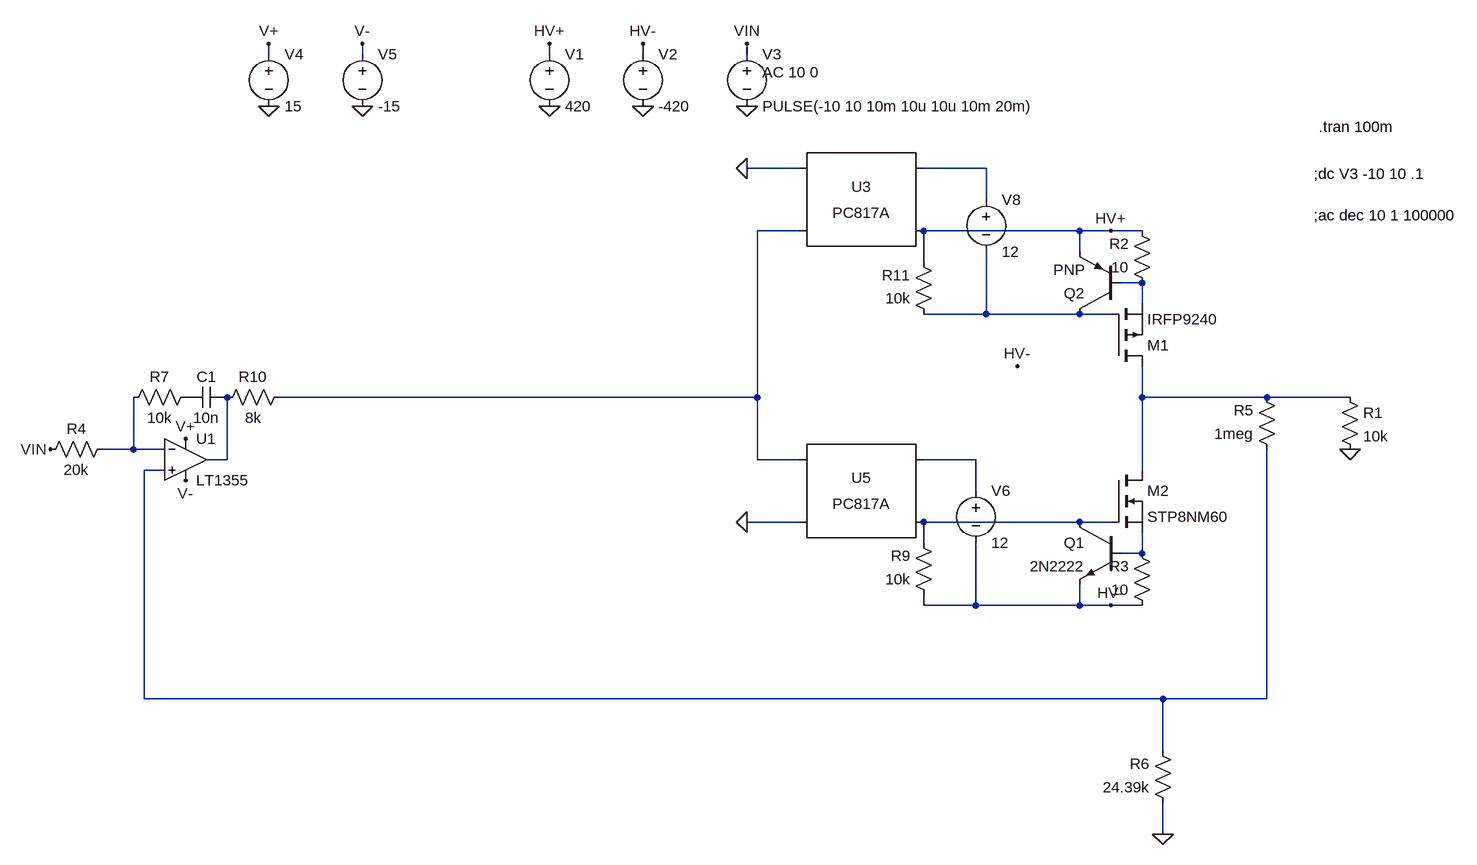
[diagram p0: schematic Draft12.asc]
Draft12.asc, the LTspice schematic file:
Version 4
SHEET 1 968 932
WIRE -976 -336 -976 -352
WIRE -832 -336 -832 -352
WIRE -544 -336 -544 -352
WIRE -400 -336 -400 -352
WIRE -240 -336 -240 -352
WIRE -160 -160 -240 -160
WIRE 128 -160 32 -160
WIRE 128 -112 128 -160
WIRE -160 -64 -224 -64
WIRE 272 -64 32 -64
WIRE 320 -64 272 -64
WIRE 368 -64 320 -64
WIRE 272 -32 272 -64
WIRE 32 -16 32 -64
WIRE 368 16 336 16
WIRE 368 48 368 16
WIRE 128 64 128 -32
WIRE 128 64 32 64
WIRE 272 64 128 64
WIRE 320 64 272 64
WIRE -224 192 -224 -64
WIRE -224 192 -960 192
WIRE 368 192 368 144
WIRE 560 192 368 192
WIRE 688 192 560 192
WIRE -1184 272 -1184 192
WIRE -1184 272 -1232 272
WIRE -1136 272 -1184 272
WIRE -1040 288 -1040 192
WIRE -1040 288 -1072 288
WIRE -224 288 -224 192
WIRE -160 288 -224 288
WIRE 112 288 32 288
WIRE -1136 304 -1168 304
WIRE 368 304 368 192
WIRE 112 336 112 288
WIRE -160 384 -240 384
WIRE 272 384 32 384
WIRE 320 384 272 384
WIRE 32 416 32 384
WIRE 368 432 368 400
WIRE 368 432 336 432
WIRE 32 512 32 496
WIRE 112 512 112 416
WIRE 112 512 32 512
WIRE 272 512 272 480
WIRE 272 512 112 512
WIRE 320 512 272 512
WIRE 368 512 320 512
WIRE -1168 656 -1168 304
WIRE 400 656 -1168 656
WIRE 560 656 560 272
WIRE 560 656 400 656
WIRE 400 736 400 656
WIRE 400 864 400 816
FLAG -544 -256 0
FLAG -400 -256 0
FLAG -240 -256 0
FLAG -544 -352 HV+
FLAG -400 -352 HV-
FLAG -240 -352 VIN
FLAG -976 -256 0
FLAG -832 -256 0
FLAG -976 -352 V+
FLAG -832 -352 V-
FLAG -1104 256 V+
FLAG -1104 320 V-
FLAG -1312 272 VIN
FLAG 400 864 0
FLAG 176 144 HV-
FLAG 320 512 HV-
FLAG 320 -64 HV+
FLAG -240 -160 0
FLAG -240 384 0
FLAG 688 272 0
SYMBOL res 672 176 R0
SYMATTR InstName R1
SYMATTR Value 10k
SYMBOL voltage -544 -352 R0
WINDOW 123 0 0 Left 2
WINDOW 39 0 0 Left 2
SYMATTR InstName V1
SYMATTR Value 420
SYMBOL voltage -400 -352 R0
WINDOW 123 0 0 Left 2
WINDOW 39 0 0 Left 2
SYMATTR InstName V2
SYMATTR Value -420
SYMBOL voltage -240 -352 R0
WINDOW 123 24 44 Left 2
WINDOW 39 0 0 Left 2
SYMATTR Value2 AC 10 0
SYMATTR InstName V3
SYMATTR Value PULSE(-10 10 10m 10u 10u 10m 20m)
SYMBOL nmos 320 304 R0
SYMATTR InstName M2
SYMATTR Value STP8NM60
SYMBOL npn 336 384 M0
SYMATTR InstName Q1
SYMATTR Value 2N2222
SYMBOL voltage -976 -352 R0
WINDOW 123 0 0 Left 2
WINDOW 39 0 0 Left 2
SYMATTR InstName V4
SYMATTR Value 15
SYMBOL voltage -832 -352 R0
WINDOW 123 0 0 Left 2
WINDOW 39 0 0 Left 2
SYMATTR InstName V5
SYMATTR Value -15
SYMBOL Opamps\\LT1355 -1104 224 R0
SYMATTR InstName U1
SYMBOL res -1216 256 R90
WINDOW 0 0 56 VBottom 2
WINDOW 3 32 56 VTop 2
SYMATTR InstName R4
SYMATTR Value 20k
SYMBOL res 576 288 R180
WINDOW 0 36 76 Left 2
WINDOW 3 36 40 Left 2
SYMATTR InstName R5
SYMATTR Value 1meg
SYMBOL res 416 832 R180
WINDOW 0 36 76 Left 2
WINDOW 3 36 40 Left 2
SYMATTR InstName R6
SYMATTR Value 24.39k
SYMBOL res -1088 176 R90
WINDOW 0 0 56 VBottom 2
WINDOW 3 32 56 VTop 2
SYMATTR InstName R7
SYMATTR Value 10k
SYMBOL cap -1040 176 R90
WINDOW 0 0 32 VBottom 2
WINDOW 3 32 32 VTop 2
SYMATTR InstName C1
SYMATTR Value 10n
SYMBOL res -944 176 R90
WINDOW 0 0 56 VBottom 2
WINDOW 3 32 56 VTop 2
SYMATTR InstName R10
SYMATTR Value 8k
SYMBOL pnp 336 64 R180
SYMATTR InstName Q2
SYMBOL pmos 320 144 M180
SYMATTR InstName M1
SYMATTR Value IRFP9240
SYMBOL res 384 32 R180
WINDOW 0 36 76 Left 2
WINDOW 3 36 40 Left 2
SYMATTR InstName R2
SYMATTR Value 10
SYMBOL res 384 528 R180
WINDOW 0 36 76 Left 2
WINDOW 3 36 40 Left 2
SYMATTR InstName R3
SYMATTR Value 10
SYMBOL Optos\\PC817A -64 336 R0
SYMATTR InstName U5
SYMBOL res 48 512 R180
WINDOW 0 36 76 Left 2
WINDOW 3 36 40 Left 2
SYMATTR InstName R9
SYMATTR Value 10k
SYMBOL voltage 112 320 R0
WINDOW 123 0 0 Left 2
WINDOW 39 0 0 Left 2
SYMATTR InstName V6
SYMATTR Value 12
SYMBOL Optos\\PC817A -64 -112 R0
SYMATTR InstName U3
SYMBOL res 48 80 R180
WINDOW 0 36 76 Left 2
WINDOW 3 36 40 Left 2
SYMATTR InstName R11
SYMATTR Value 10k
SYMBOL voltage 128 -128 R0
WINDOW 123 0 0 Left 2
WINDOW 39 0 0 Left 2
SYMATTR InstName V8
SYMATTR Value 12
TEXT 632 -88 Left 2 !;ac dec 10 1 100000
TEXT 632 -152 Left 2 !;dc V3 -10 10 .1
TEXT 640 -224 Left 2 !.tran 100m

The netlist it stands for:
* Draft12.asc
R1 N005 0 10k
V1 HV+ 0 420
V2 HV- 0 -420
V3 VIN 0 PULSE(-10 10 10m 10u 10u 10m 20m) AC 10 0
M2 N005 N010 N011 N011 STP8NM60
Q1 N010 N011 HV- 0 2N2222
V4 V+ 0 15
V5 V- 0 -15
XU1 N009 N006 V+ V- N007 LT1355  ; pins In+ In- V+ V- OUT
R4 N006 VIN 20k
R5 N009 N005 1meg
R6 0 N009 24.39k
R7 P001 N006 10k
C1 N007 P001 10n
R10 N002 N007 8k
Q2 N004 N003 HV+ 0 PNP
M1 N005 N004 N003 N003 IRFP9240
R2 N003 HV+ 10
R3 HV- N011 10
XU5 N002 0 N008 N010 PC817 Igain=1m
R9 HV- N010 10k
V6 N008 HV- 12
XU3 0 N002 N001 HV+ PC817 Igain=1m
R11 N004 HV+ 10k
V8 N001 N004 12
.model NPN NPN
.model PNP PNP
.lib standard.bjt
.model NMOS NMOS
.model PMOS PMOS
.lib standard.mos
;ac dec 10 1 100000
;dc V3 -10 10 .1
.tran 100m
.lib PC817.sub
.backanno
.end